# EAGLE design kilo-issue3-dual (EAGLE 9.2.2)

## Sheet 1 of 2
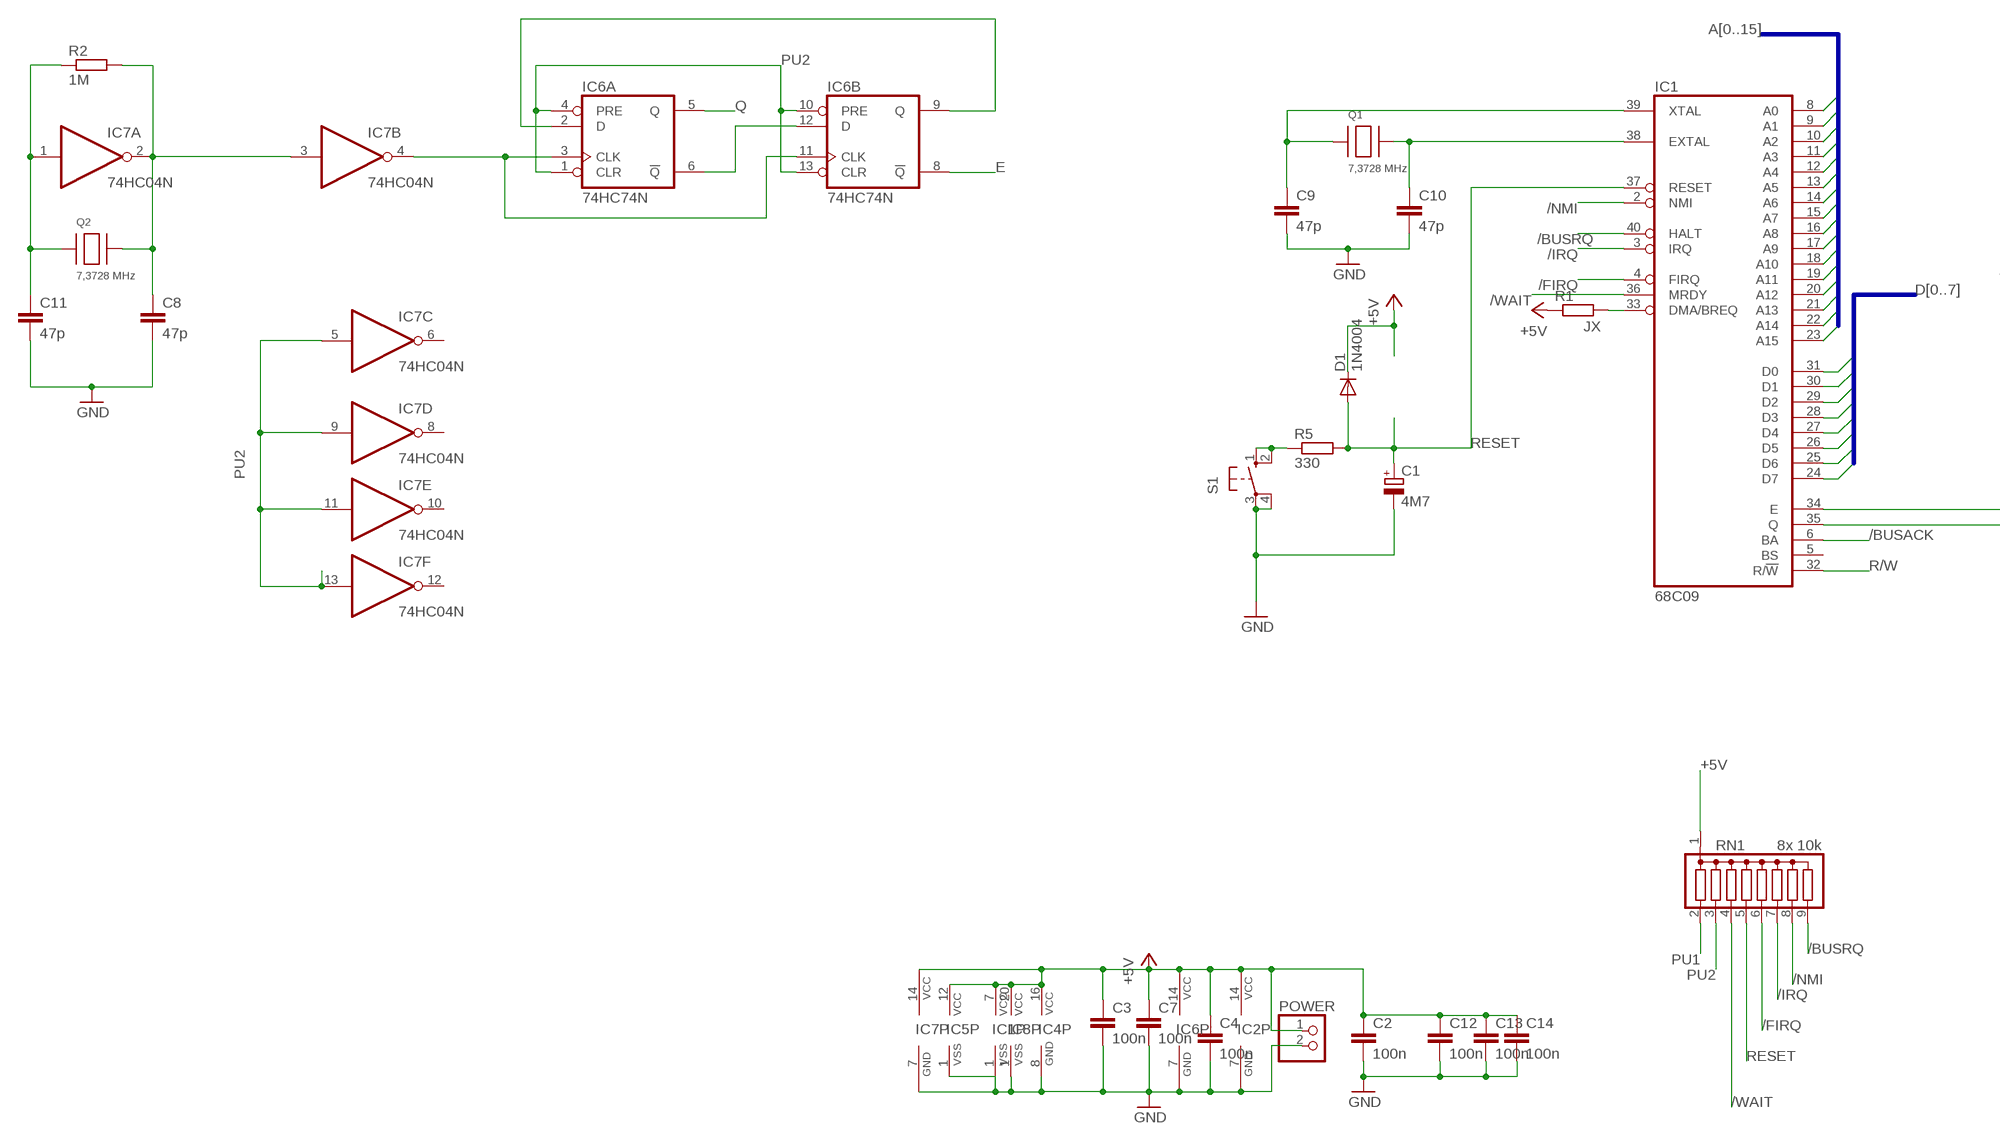
[diagram p0: schematic, sheet 1, part 1 of 2]
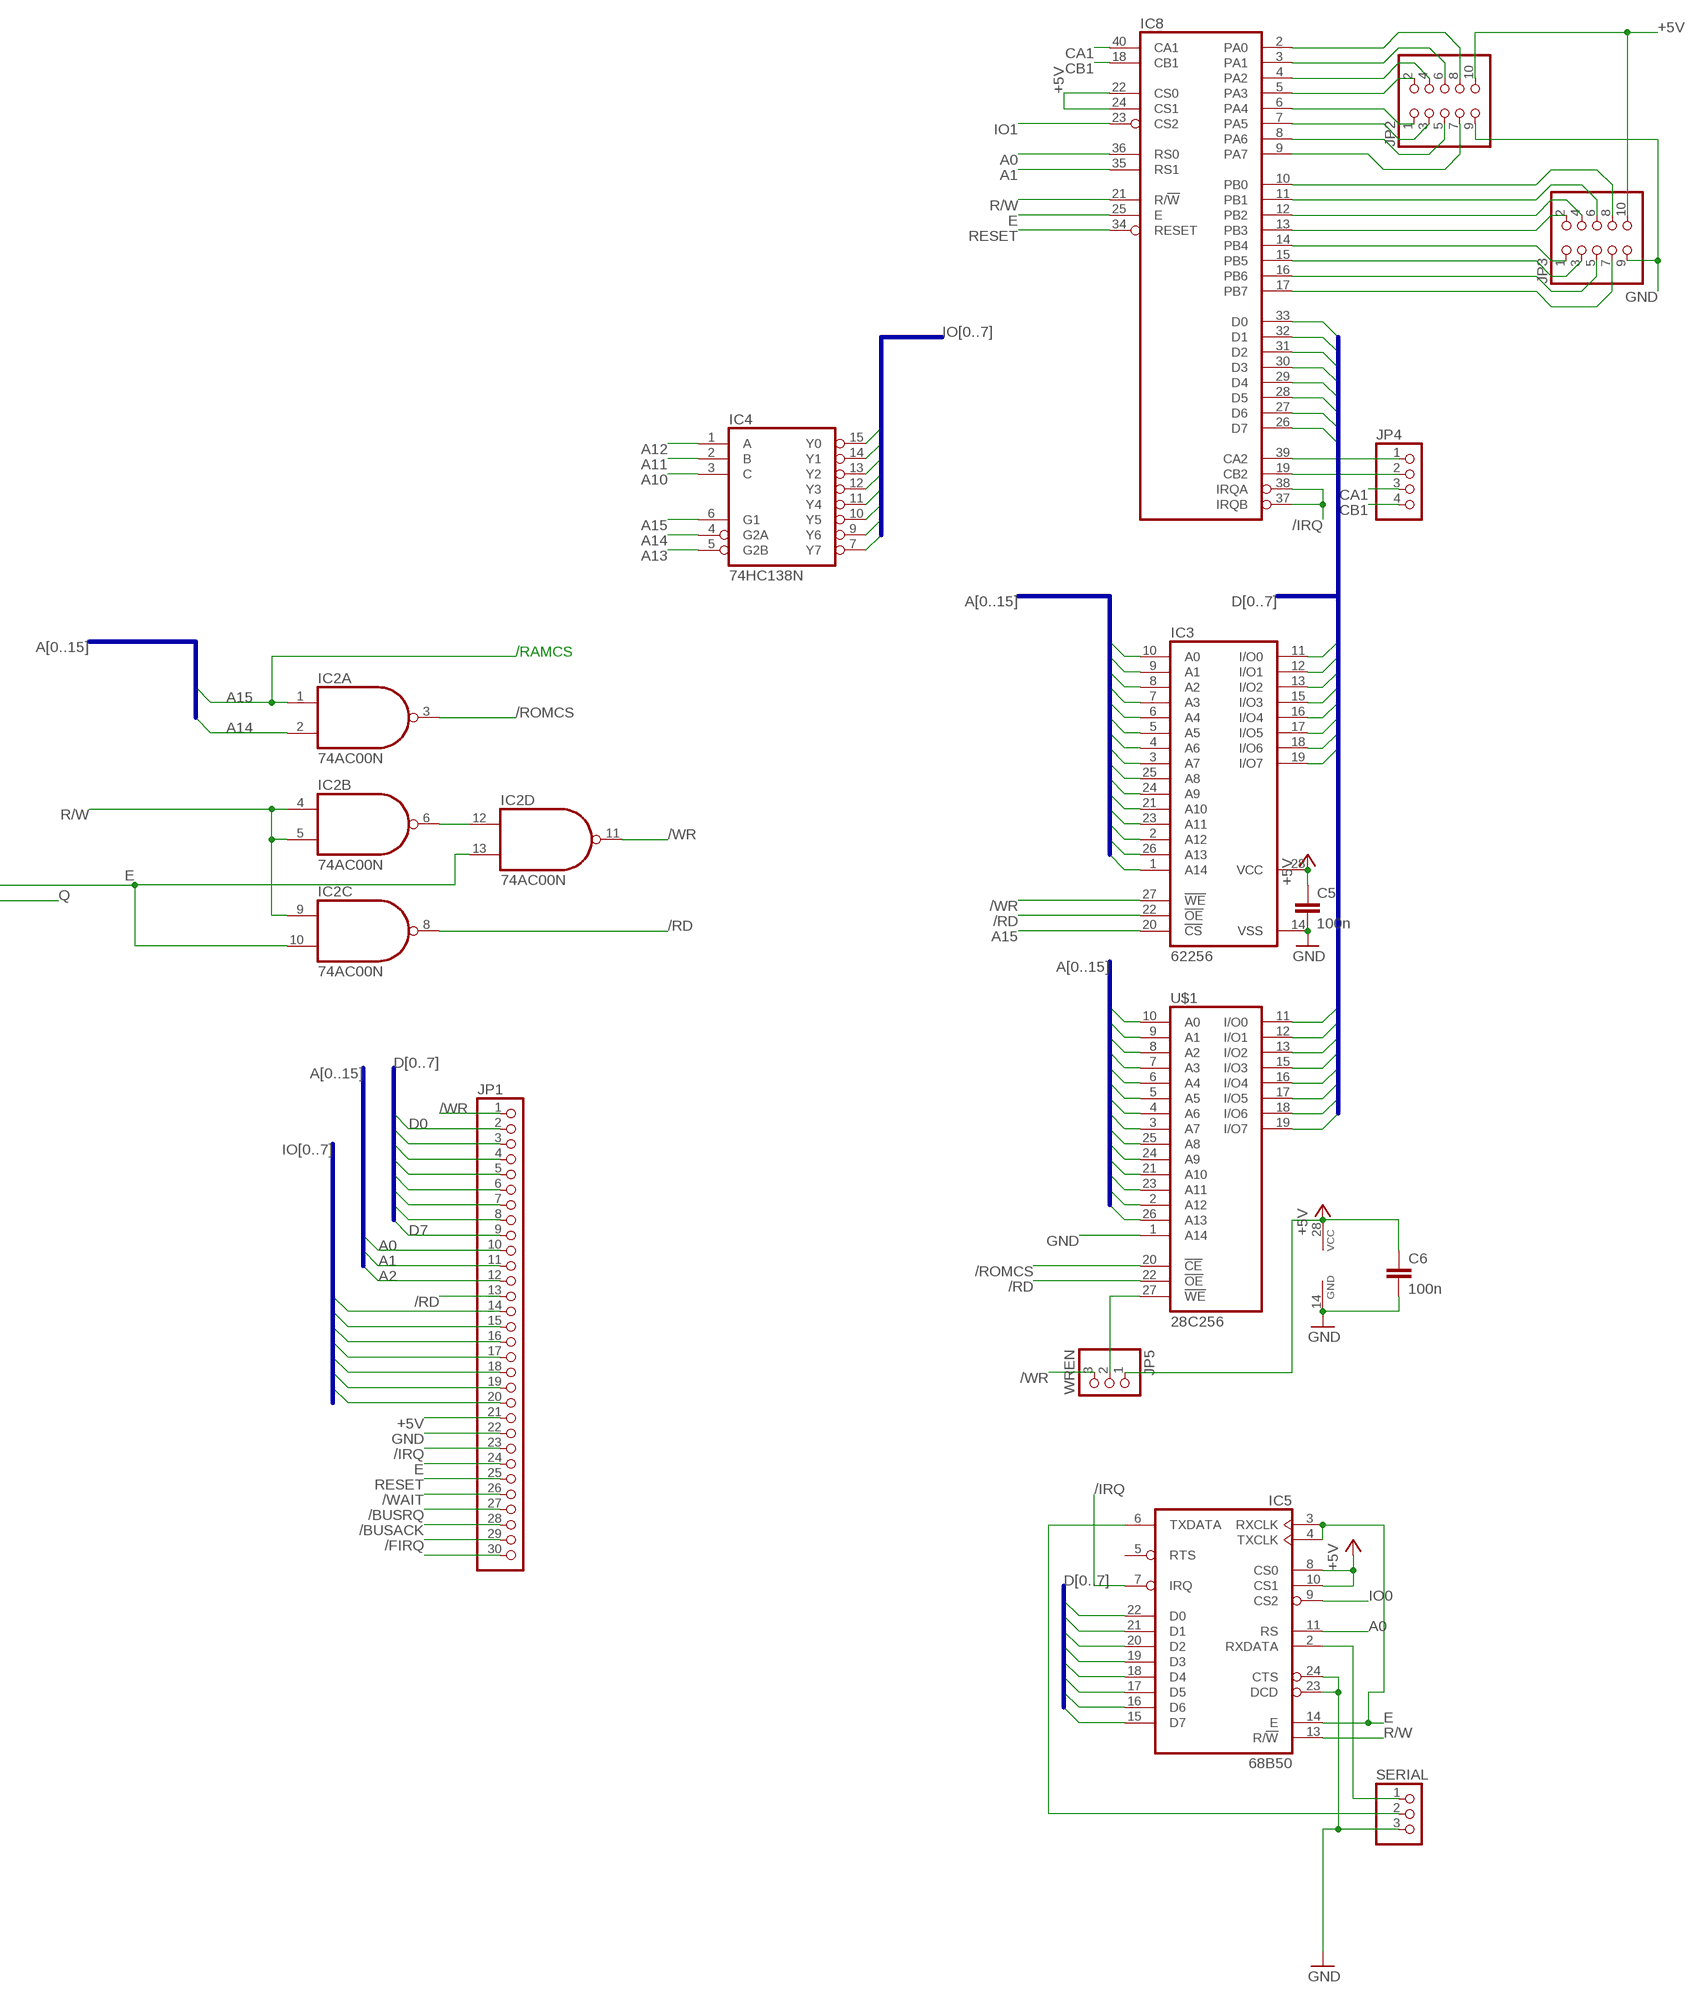
[diagram p1: schematic, sheet 1, part 2 of 2]

### Parts
C1  4M7  CPOL-EUE2.5-6  [E2,5-6]
C2  100n  C-EU025-030X050  [C025-030X050]
C3  100n  C-EU025-030X050  [C025-030X050]
C4  100n  C-EU025-030X050  [C025-030X050]
C5  100n  C-EU025-030X050  [C025-030X050]
C6  100n  C-EU025-030X050  [C025-030X050]
C7  100n  C-EU025-030X050  [C025-030X050]
C8  47p  C-EU025-030X050  [C025-030X050]
C9  47p  C-EU025-030X050  [C025-030X050]
C10  47p  C-EU025-030X050  [C025-030X050]
C11  47p  C-EU025-030X050  [C025-030X050]
C12  100n  C-EU025-030X050  [C025-030X050]
C13  100n  C-EU025-030X050  [C025-030X050]
C14  100n  C-EU025-030X050  [C025-030X050]
D1  1N4004  [DO41-10]
IC1  68C09  6809  [DIL40]
IC2  74AC00N  74ALS00N  [DIL14]
IC3  62256  62256P  [DIL28-6]
IC4  74HC138N  [DIL16]
IC5  68B50  6850  [DIL24]
IC6  74HC74N  74LS74N  [DIL14]
IC7  74HC04N  74ALS04N  [DIL14]
IC8  6821  [DIL40]
JP1  PINHD-1X30  [1X30]
JP2  PINHD-2X5  [2X05]
JP3  PINHD-2X5  [2X05]
JP4  PINHD-1X4  [1X04]
JP5  WREN  PINHD-1X3  [1X03]
POWER  PINHD-1X2  [1X02]
Q1  7,3728 MHz  306010080_XTAL_8MHZ_HC49US  [HC49US]
Q2  7,3728 MHz  306010080_XTAL_8MHZ_HC49US  [HC49US]
R1  JX  R-EU_M0805  [M0805]
R2  1M  R-EU_0207/7  [0207/7]
R5  330  R-EU_0207/7  [0207/7]
RN1  8x 10k  G08R  [SIL9]
S1  40-XX  [B3F-40XX]
SERIAL  PINHD-1X3  [1X03]
U$1  28C256  [DIL28]

### Nets
+5V [supply]: C2.1 C3.1 C4.1 C5.1 C6.1 C7.1 C12.1 C13.1 C14.1 D1.C IC1.7(VCC) IC2.14(P:VCC) IC3.28(VCC) IC4.16(VCC) IC5.8(CS0) IC5.10(CS1) IC5.12(VCC) IC6.14(P:VCC) IC7.14(P:VCC) IC8.20(VCC) IC8.22(CS0) IC8.24(CS1) JP1.21 JP2.10 JP3.10 JP5.1 POWER.1 R1.1 RN1.1 U$1.28(VCC)
/BUSACK: IC1.6(BA) JP1.28
/BUSRQ: IC1.40(HALT) JP1.27 RN1.9
/FIRQ: IC1.4(FIRQ) JP1.29 RN1.6
/IRQ: IC1.3(IRQ) IC5.7(IRQ) IC8.37(IRQB) IC8.38(IRQA) JP1.23 RN1.7
/NMI: IC1.2(NMI) RN1.8
/RD: IC2.8(C:O) IC3.22(!OE) JP1.13 U$1.22(!OE)
/ROMCS: IC2.3(A:O) U$1.20(!CE)
/WAIT: IC1.36(MRDY) JP1.26 RN1.4
/WR: IC2.11(D:O) IC3.27(!WE) JP1.1 JP5.3
A0: IC1.8(A0) IC3.10(A0) IC5.11(RS) IC8.36(RS0) JP1.10 U$1.10(A0)
A1: IC1.9(A1) IC3.9(A1) IC8.35(RS1) JP1.11 U$1.9(A1)
A2: IC1.10(A2) IC3.8(A2) JP1.12 U$1.8(A2)
A3: IC1.11(A3) IC3.7(A3) U$1.7(A3)
A4: IC1.12(A4) IC3.6(A4) U$1.6(A4)
A5: IC1.13(A5) IC3.5(A5) U$1.5(A5)
A6: IC1.14(A6) IC3.4(A6) U$1.4(A6)
A7: IC1.15(A7) IC3.3(A7) U$1.3(A7)
A8: IC1.16(A8) IC3.25(A8) U$1.25(A8)
A9: IC1.17(A9) IC3.24(A9) U$1.24(A9)
A10: IC1.18(A10) IC3.21(A10) IC4.3(C) U$1.21(A10)
A11: IC1.19(A11) IC3.23(A11) IC4.2(B) U$1.23(A11)
A12: IC1.20(A12) IC3.2(A12) IC4.1(A) U$1.2(A12)
A13: IC1.21(A13) IC3.26(A13) IC4.5(G2B) U$1.26(A13)
A14: IC1.22(A14) IC2.2(A:I1) IC3.1(A14) IC4.4(G2A)
A15: IC1.23(A15) IC2.1(A:I0) IC3.20(!CS) IC4.6(G1)
CA1: IC8.40(CA1) JP4.3
CB1: IC8.18(CB1) JP4.4
D0: IC1.31(D0) IC3.11(I/O0) IC5.22(D0) IC8.33(D0) JP1.2 U$1.11(I/O0)
D1: IC1.30(D1) IC3.12(I/O1) IC5.21(D1) IC8.32(D1) JP1.3 U$1.12(I/O1)
D2: IC1.29(D2) IC3.13(I/O2) IC5.20(D2) IC8.31(D2) JP1.4 U$1.13(I/O2)
D3: IC1.28(D3) IC3.15(I/O3) IC5.19(D3) IC8.30(D3) JP1.5 U$1.15(I/O3)
D4: IC1.27(D4) IC3.16(I/O4) IC5.18(D4) IC8.29(D4) JP1.6 U$1.16(I/O4)
D5: IC1.26(D5) IC3.17(I/O5) IC5.17(D5) IC8.28(D5) JP1.7 U$1.17(I/O5)
D6: IC1.25(D6) IC3.18(I/O6) IC5.16(D6) IC8.27(D6) JP1.8 U$1.18(I/O6)
D7: IC1.24(D7) IC3.19(I/O7) IC5.15(D7) IC8.26(D7) JP1.9 U$1.19(I/O7)
E: IC1.34(E) IC2.10(C:I1) IC2.13(D:I1) IC5.3(RXCLK) IC5.4(TXCLK) IC5.14(E) IC6.8(B:!Q) IC8.25(E) JP1.24
GND [supply]: C1.- C2.2 C3.2 C4.2 C5.2 C6.2 C7.2 C8.2 C9.2 C10.2 C11.2 C12.2 C13.2 C14.2 IC1.1(VSS) IC2.7(P:GND) IC3.14(VSS) IC4.8(GND) IC5.1(VSS) IC5.23(DCD) IC5.24(CTS) IC6.7(P:GND) IC7.7(P:GND) IC8.1(VSS) JP1.22 JP2.9 JP3.9 POWER.2 S1.3(P) S1.4(P1) SERIAL.3 U$1.1(A14) U$1.14(GND)
IO0: IC4.15(Y0) IC5.9(CS2)
IO1: IC4.14(Y1) IC8.23(CS2) JP1.14
IO2: IC4.13(Y2) JP1.15
IO3: IC4.12(Y3) JP1.16
IO4: IC4.11(Y4) JP1.17
IO5: IC4.10(Y5) JP1.18
IO6: IC4.9(Y6) JP1.19
IO7: IC4.7(Y7) JP1.20
N$1: R5.1 S1.1(S) S1.2(S1)
N$2: IC1.33(DMA/BREQ) R1.2
N$3: IC6.2(A:D) IC6.9(B:Q)
N$4: IC6.3(A:CLK) IC6.11(B:CLK) IC7.4(B:O)
N$5: IC6.6(A:!Q) IC6.12(B:D)
N$6: C8.1 IC7.2(A:O) IC7.3(B:I) Q2.P$2 R2.2
N$7: C11.1 IC7.1(A:I) Q2.P$1 R2.1
N$8: JP1.30
N$9: IC8.6(PA4) JP2.1
N$10: IC2.6(B:O) IC2.12(D:I0)
N$11: IC8.7(PA5) JP2.3
N$12: IC8.8(PA6) JP2.5
N$13: IC8.9(PA7) JP2.7
N$14: IC8.5(PA3) JP2.2
N$15: IC8.4(PA2) JP2.4
N$16: IC8.3(PA1) JP2.6
N$17: IC8.2(PA0) JP2.8
N$18: IC8.13(PB3) JP3.2
N$19: IC8.14(PB4) JP3.1
N$20: IC8.12(PB2) JP3.4
N$21: IC8.15(PB5) JP3.3
N$22: IC8.11(PB1) JP3.6
N$23: IC8.16(PB6) JP3.5
N$24: IC8.17(PB7) JP3.7
N$25: IC8.10(PB0) JP3.8
N$26: IC8.39(CA2) JP4.1
N$27: IC8.19(CB2) JP4.2
N$28: JP5.2 U$1.27(!WE)
N$33: C10.1 IC1.38(EXTAL) Q1.P$2
N$35: IC5.2(RXDATA) SERIAL.1
N$36: IC5.6(TXDATA) SERIAL.2
PHI0: C9.1 IC1.39(XTAL) Q1.P$1
PU1: RN1.2
PU2: IC6.1(A:CLR) IC6.4(A:PRE) IC6.10(B:PRE) IC6.13(B:CLR) IC7.5(C:I) IC7.9(D:I) IC7.11(E:I) IC7.13(F:I) RN1.3
Q: IC1.35(Q) IC6.5(A:Q)
R/W: IC1.32(R/!W) IC2.4(B:I0) IC2.5(B:I1) IC2.9(C:I0) IC5.13(R/!W) IC8.21(R/!W)
RESET: C1.+ D1.A IC1.37(RESET) IC8.34(RESET) JP1.25 R5.2 RN1.5
Unconnected: IC1.5(BS) IC5.5(RTS) IC7.6(C:O) IC7.8(D:O) IC7.10(E:O) IC7.12(F:O)

### Buses
A[0..15]
D[0..7]
IO[0..7]

### Notes on the sheet
- /RAMCS

## Sheet 2 of 2

## Library data of the parts
C1 = rcl:CPOL-EU: POLARIZED CAPACITOR, European symbol
C2-C14 = rcl:C-EU: CAPACITOR, European symbol
D1 = adafruit:1N4004: DIODE General purpose 1N400x type rectifier (With bigger pads) http://www.ladyada.net/library/pcb/eaglelibrary.html
IC1 = micro-motorola:6809: MICROCONTROLLER/MEMORY DEVICE; MF: NTE ELECTRONICS; MPN: NTE6809; OC_FARNELL: 4530354; OC_NEWARK: 31C2459
IC2 = 74xx-us:74*00: Quad 2-input NAND gate
IC3 = memory-hitachi:62256P: MEMORY; OC_FARNELL: unknown; OC_NEWARK: unknown
IC4 = 74xx-eu:74*138: 3-line to 8-line DECODER/DEMULTIPLEXER
IC5 = micro-motorola:6850: MICROCONTROLLER/MEMORY DEVICE; MF: NTE ELECTRONICS; MPN: NTE6850; OC_FARNELL: 4899775; OC_NEWARK: 31C2457
IC6 = 74xx-us:74*74: Dual D type positive edge triggered FLIP FLOP, preset and clear
IC7 = 74xx-us:74*04: Hex INVERTER
IC8 = micro-motorola:6821: MICROCONTROLLER/MEMORY DEVICE; MF: NTE ELECTRONICS; MPN: NTE6821; OC_FARNELL: 1652403; OC_NEWARK: 29C4772
JP1 = pinhead:PINHD-1X30: PIN HEADER
JP2 JP3 = pinhead:PINHD-2X5: PIN HEADER
JP4 = pinhead:PINHD-1X4: PIN HEADER
JP5 SERIAL = pinhead:PINHD-1X3: PIN HEADER
POWER = pinhead:PINHD-1X2: PIN HEADER
Q1 Q2 = Seeed-OPL-2017-01-Crystal-Akita:306010080_XTAL_8MHZ_HC49US: HC49/US-11.35X4.65X3.6, DIP Crystal 8MHz-20pF-30ppm-80R, SKU: 306010080
R1 = rcl:R-EU_: RESISTOR, European symbol; SPICEPREFIX: R
R2 R5 = rcl:R-EU_: RESISTOR, European symbol
RN1 = resistor-sil:G08R: SIL RESISTOR; OC_FARNELL: unknown; OC_NEWARK: unknown
S1 = adafruit:40-XX: OMRON SWITCH; MF: OMRON COMPONENTS USA; MPN: B3F-4000; OC_FARNELL: 176434; OC_NEWARK: 36K3105
U$1 = memory:28C256: MEMORY

## Net classes
1 supply: width 0.61 mm

## Board
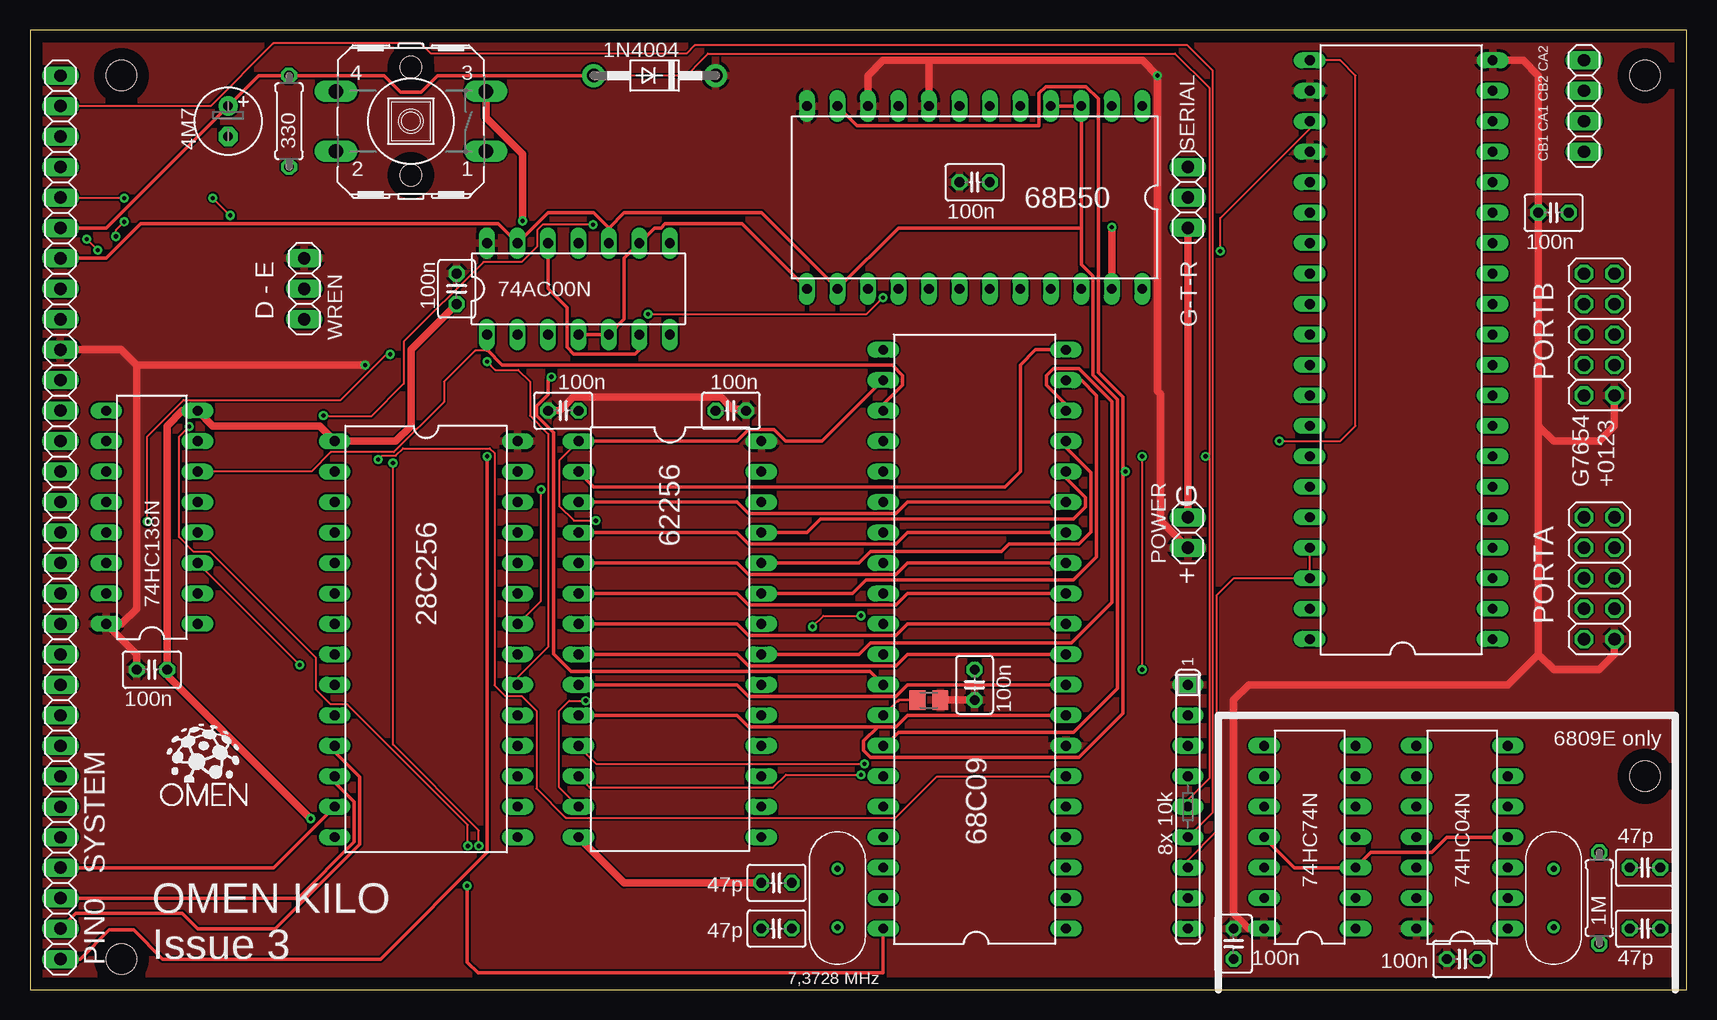
[diagram p2: board, top side]
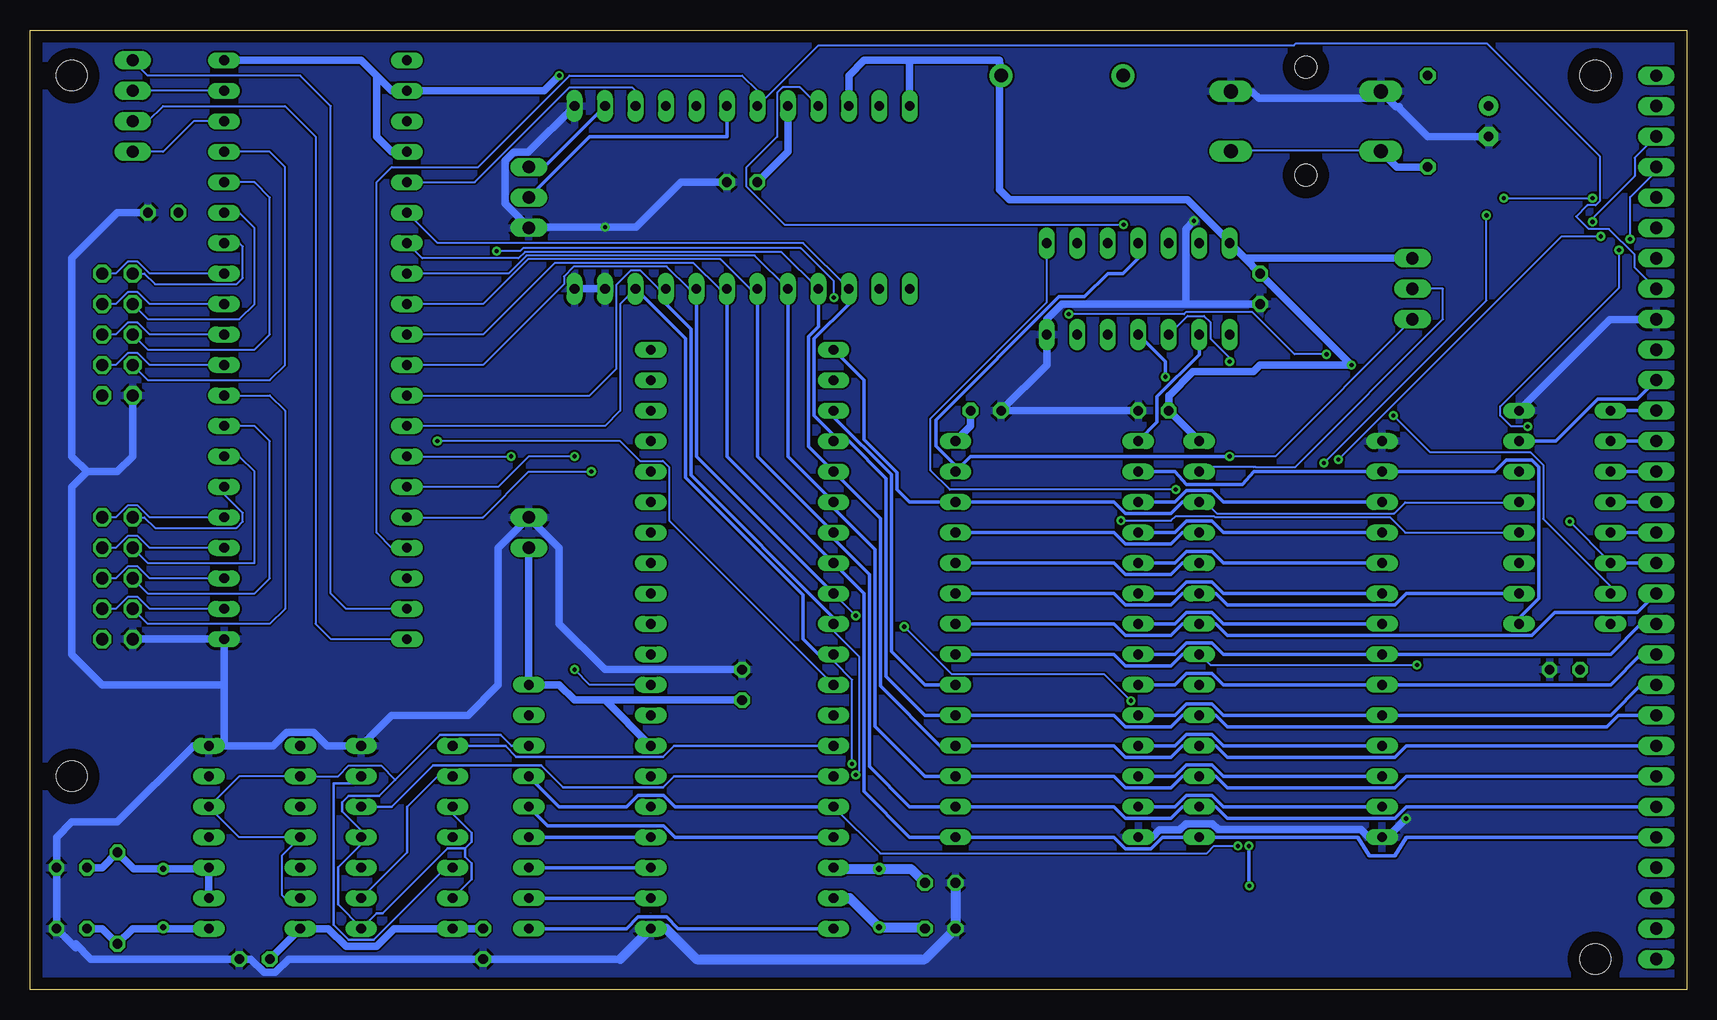
[diagram p3: board, bottom side, seen from below]

Size 138.1 x 80 mm. Coordinates in mm from the lower left corner, seen from the top.
Outline: 0,0 138.1,0 138.1,80 0,80 0,0
Copper layers (1*16): Top 0.035mm / dielectric 1.5mm / Bottom 0.035mm
Design rules "default": minimum track width 6mil, minimum drill 0.35mm, track to track 6mil, track to pad 6mil, pad to pad 6mil, via to via 6mil, smd to smd 6mil, copper to edge 40mil, drill to drill 6mil, minimum pad ring 10mil, minimum via ring 8mil, stop-mask expansion 4mil, vias tented up to drill 0mil, thermal gap 10mil
Holes 2.54 mm at 7.62,2.54 7.62,76.2 134.62,76.2 134.62,17.78

### Footprints (pad centres in the part's own frame; a part is rotated, then mirrored left to right if it is on the bottom)
E2,5-6 = drill 0.813 pad 1.6: + -1.27,0 | drill 0.813 pad 1.6 octagon: - 1.27,0
C025-030X050 = drill 0.813 octagon: 1 -1.27,0; 2 1.27,0
DO41-10 = drill 1.118 pad 1.93: A 5.08,0; C -5.08,0
DIL40 = drill 0.813 long: 1 -24.13,-7.62; 2 -21.59,-7.62; 3 -19.05,-7.62; 4 -16.51,-7.62; 5 -13.97,-7.62; 6 -11.43,-7.62; 7 -8.89,-7.62; 8 -6.35,-7.62; 9 -3.81,-7.62; 10 -1.27,-7.62; 11 1.27,-7.62; 12 3.81,-7.62; 13 6.35,-7.62; 14 8.89,-7.62; 15 11.43,-7.62; 16 13.97,-7.62; 17 16.51,-7.62; 18 19.05,-7.62; 19 21.59,-7.62; 20 24.13,-7.62; 21 24.13,7.62; 22 21.59,7.62; 23 19.05,7.62; 24 16.51,7.62; 25 13.97,7.62; 26 11.43,7.62; 27 8.89,7.62; 28 6.35,7.62; 29 3.81,7.62; 30 1.27,7.62; 31 -1.27,7.62; 32 -3.81,7.62; 33 -6.35,7.62; 34 -8.89,7.62; 35 -11.43,7.62; 36 -13.97,7.62; 37 -16.51,7.62; 38 -19.05,7.62; 39 -21.59,7.62; 40 -24.13,7.62
DIL14 = drill 0.813 long: 1 -7.62,-3.81; 2 -5.08,-3.81; 3 -2.54,-3.81; 4 0,-3.81; 5 2.54,-3.81; 6 5.08,-3.81; 7 7.62,-3.81; 8 7.62,3.81; 9 5.08,3.81; 10 2.54,3.81; 11 0,3.81; 12 -2.54,3.81; 13 -5.08,3.81; 14 -7.62,3.81
DIL28-6 = drill 0.813 long: 1 -16.51,-7.62; 2 -13.97,-7.62; 3 -11.43,-7.62; 4 -8.89,-7.62; 5 -6.35,-7.62; 6 -3.81,-7.62; 7 -1.27,-7.62; 8 1.27,-7.62; 9 3.81,-7.62; 10 6.35,-7.62; 11 8.89,-7.62; 12 11.43,-7.62; 13 13.97,-7.62; 14 16.51,-7.62; 15 16.51,7.62; 16 13.97,7.62; 17 11.43,7.62; 18 8.89,7.62; 19 6.35,7.62; 20 3.81,7.62; 21 1.27,7.62; 22 -1.27,7.62; 23 -3.81,7.62; 24 -6.35,7.62; 25 -8.89,7.62; 26 -11.43,7.62; 27 -13.97,7.62; 28 -16.51,7.62
DIL16 = drill 0.813 long: 1 -8.89,-3.81; 2 -6.35,-3.81; 3 -3.81,-3.81; 4 -1.27,-3.81; 5 1.27,-3.81; 6 3.81,-3.81; 7 6.35,-3.81; 8 8.89,-3.81; 9 8.89,3.81; 10 6.35,3.81; 11 3.81,3.81; 12 1.27,3.81; 13 -1.27,3.81; 14 -3.81,3.81; 15 -6.35,3.81; 16 -8.89,3.81
DIL24 = drill 0.813 long: 1 -13.97,-7.62; 2 -11.43,-7.62; 3 -8.89,-7.62; 4 -6.35,-7.62; 5 -3.81,-7.62; 6 -1.27,-7.62; 7 1.27,-7.62; 8 3.81,-7.62; 9 6.35,-7.62; 10 8.89,-7.62; 11 11.43,-7.62; 12 13.97,-7.62; 13 13.97,7.62; 14 11.43,7.62; 15 8.89,7.62; 16 6.35,7.62; 17 3.81,7.62; 18 1.27,7.62; 19 -1.27,7.62; 20 -3.81,7.62; 21 -6.35,7.62; 22 -8.89,7.62; 23 -11.43,7.62; 24 -13.97,7.62
1X30 = drill 1.016 long: 1 -36.83,0; 2 -34.29,0; 3 -31.75,0; 4 -29.21,0; 5 -26.67,0; 6 -24.13,0; 7 -21.59,0; 8 -19.05,0; 9 -16.51,0; 10 -13.97,0; 11 -11.43,0; 12 -8.89,0; 13 -6.35,0; 14 -3.81,0; 15 -1.27,0; 16 1.27,0; 17 3.81,0; 18 6.35,0; 19 8.89,0; 20 11.43,0; 21 13.97,0; 22 16.51,0; 23 19.05,0; 24 21.59,0; 25 24.13,0; 26 26.67,0; 27 29.21,0; 28 31.75,0; 29 34.29,0; 30 36.83,0
2X05 = drill 1.016 octagon: 1 -5.08,-1.27; 2 -5.08,1.27; 3 -2.54,-1.27; 4 -2.54,1.27; 5 0,-1.27; 6 0,1.27; 7 2.54,-1.27; 8 2.54,1.27; 9 5.08,-1.27; 10 5.08,1.27
1X04 = drill 1.016 long: 1 -3.81,0; 2 -1.27,0; 3 1.27,0; 4 3.81,0
1X03 = drill 1.016 long: 1 -2.54,0; 2 0,0; 3 2.54,0
1X02 = drill 1.016 long: 1 -1.27,0; 2 1.27,0
HC49US = drill 0.5: P$1 -2.44,0; P$2 2.44,0
M0805 = smd 1.3 x 1.6: 1 -0.95,0; 2 0.95,0
0207/7 = drill 0.813 octagon: 1 -3.81,0; 2 3.81,0
SIL9 = drill 0.813 long: 1 -10.16,0; 2 -7.62,0; 3 -5.08,0; 4 -2.54,0; 5 0,0; 6 2.54,0; 7 5.08,0; 8 7.62,0; 9 10.16,0
B3F-40XX = drill 1.194 long: 1 -6.248,2.489; 2 6.248,2.489; 3 -6.248,-2.489; 4 6.248,-2.489 | hole 1.803: 0,-4.496; 0,4.496
DIL28 = drill 0.813 long: 1 -16.51,-7.62; 2 -13.97,-7.62; 3 -11.43,-7.62; 4 -8.89,-7.62; 5 -6.35,-7.62; 6 -3.81,-7.62; 7 -1.27,-7.62; 8 1.27,-7.62; 9 3.81,-7.62; 10 6.35,-7.62; 11 8.89,-7.62; 12 11.43,-7.62; 13 13.97,-7.62; 14 16.51,-7.62; 15 16.51,7.62; 16 13.97,7.62; 17 11.43,7.62; 18 8.89,7.62; 19 6.35,7.62; 20 3.81,7.62; 21 1.27,7.62; 22 -1.27,7.62; 23 -3.81,7.62; 24 -6.35,7.62; 25 -8.89,7.62; 26 -11.43,7.62; 27 -13.97,7.62; 28 -16.51,7.62

### Placement (x,y rotation side)
C1  16.51,72.39 270 top
C2  58.42,48.26 180 top
C3  44.45,48.26 0 top
C4  10.16,26.67 0 top
C5  35.56,58.42 270 top
C6  78.74,25.4 90 top
C7  78.74,67.31 0 top
C8  134.62,10.16 0 top
C9  62.23,5.08 180 top
C10  62.23,8.89 180 top
C11  134.62,5.08 0 top
C12  100.33,3.81 270 top
C13  119.38,2.54 0 top
C14  127,64.77 0 top
D1  52.07,76.2 180 top
IC1  78.74,29.21 90 top
IC2  45.72,58.42 0 top
IC3  53.34,29.21 270 top
IC4  10.16,39.37 90 top
IC5  78.74,66.04 180 top
IC6  106.68,12.7 90 top
IC7  119.38,12.7 90 top
IC8  114.3,53.34 90 top
JP1  2.54,39.37 90 top
JP2  130.81,34.29 270 top
JP3  130.81,54.61 270 top
JP4  129.54,73.66 270 top
JP5  22.86,58.42 270 top
POWER  96.52,38.1 90 top
Q1  67.31,7.62 90 top
Q2  127,7.62 90 top
R1  74.93,24.13 180 top
R2  130.81,7.62 90 top
R5  21.59,72.39 90 top
RN1  96.52,15.24 270 top
S1  31.75,72.39 180 top
SERIAL  96.52,66.04 270 top
U$1  33.02,29.21 270 top

### Tracks (layer width: path | path; a pad name or v marks a point on that pad's centre or on a via)
+5V  (via drill 0.35)
  Top 0.61: 8.89,52.07 8.89,31.75 7.62,30.48 IC4.16 8.89,27.94 C4.1 | 8.89,52.07 7.62,53.34 JP1.21 | POWER.1 94.23,39.12 94.23,49.65 93.98,49.9 v93.98,76.2 92.71,77.47 74.93,77.47 | 74.93,77.47 71.12,77.47 69.85,76.2 IC5.10 | C3.1 44.14,48.26 45.26,49.38 57.61,49.38 58.58,48.41 59.53,48.41 C2.1 | v27.94,52.07 8.89,52.07 | 40.69,45.72 U$1.28 | IC5.8 74.93,77.47 | R1.1 C6.1 | IC8.20 124.46,77.47 125.73,76.2 C14.1 125.73,46.99 | 125.73,46.99 127,45.72 130.81,45.72 132.08,46.99 JP3.10 | JP2.10 132.08,27.94 130.81,26.67 127,26.67 125.73,27.94 | 125.73,27.94 125.73,46.99 | 125.73,27.94 123.19,25.4 101.6,25.4 100.33,24.13 100.33,6.35 101.6,5.08 IC6.14
  Bottom 0.61: U$1.28 C3.1 43.18,49.53 43.13,49.53 41.15,51.51 36.12,51.51 35.56,52.07 v27.94,52.07 C5.1 36.83,60.96 | IC3.28 59.69,46.99 C2.1 | C6.1 90.17,24.13 | 90.17,24.13 92.71,24.13 93.98,25.4 RN1.1 POWER.1 | C7.1 74.93,69.85 IC5.8 | D1.C 57.3,77.47 | 57.3,77.47 64.77,77.47 | 64.77,77.47 68.58,77.47 69.85,76.2 IC5.10 | IC5.12 64.77,77.47 | 57.3,77.47 57.3,66.67 56.46,65.84 41.6,65.84 38.25,62.48 IC2.14 37.47,61.59 36.83,60.96 | IC1.7 90.17,24.13 | IC8.20 110.49,77.47 109.22,76.2 | 109.22,76.2 107.95,74.93 IC8.22 95.25,74.93 v93.98,76.2 | IC8.24 107.95,69.85 109.22,71.12 109.22,76.2 | C12.1 IC6.14 107.75,5.08 109.22,3.61 111.76,3.61 113.23,5.08 IC7.14 C13.1 | JP5.1 36.83,60.96
  pour Top: 0,80.01 138.43,80.01 138.43,0 0,0
/BUSACK  (via drill 0.35)
  Top 0.152: v29.03,44.2 29.34,44.5 30.48,44.5 31.09,45.11 38.33,45.11 38.71,44.73 38.71,25.38 39.62,24.46 41,24.46 42.22,23.24 42.22,16.76 44.65,14.33 72.16,14.33 75.59,17.75 86.33,17.75 IC1.6 | v7.16,62.79 7.16,63.32 v7.85,64.01
  Bottom 0.152: v29.03,44.2 10.44,62.79 v7.16,62.79 | v7.85,64.01 7.85,64.31 4.34,67.82 4.34,69.34 2.59,71.09 JP1.28
/BUSRQ  (via drill 0.35)
  Top 0.152: v5.64,61.65 v4.72,62.56 | v13.26,46.94 12.42,46.1 12.42,37.72 13.64,36.5 15.01,36.5 23.85,27.66 23.85,24.99 25.07,23.77 26.44,23.77 36.5,13.72 v36.5,11.96
  Top 0.305: IC1.40 71.12,1.39 37.34,1.39 36.45,2.29 v36.45,8.64
  Bottom 0.152: v4.72,62.56 4.72,66.06 2.59,68.2 2.59,68.58 JP1.27 | v5.64,61.65 5.64,58.52 15.54,48.62 15.54,47.85 14.63,46.94 v13.26,46.94
  Bottom 0.305: IC1.40 84.08,5.08 85.05,6.04 87.42,6.04 88.39,5.08 RN1.9 | v36.45,8.64 36.5,8.69 v36.5,11.96
/FIRQ
  Top 0.152: RN1.6 98.6,14.78 98.6,76.61 96.5,78.72 55.4,78.72 54.71,78.03 33.43,78.03 32.58,78.88 20.27,78.88 15.05,73.66 JP1.29
  Bottom 0.305: IC1.4 RN1.6
/IRQ
  Top 0.152: RN1.7 96.52,10.78 98.91,13.17 98.91,32.87 100.33,34.29 IC8.38 IC8.37
  Bottom 0.152: JP1.23 2.59,58.45 4.34,60.2 4.34,61.27 6.48,63.4 8.15,63.4 9.21,64.45 8.28,65.38 7.6,65.38 7.24,65.74 7.24,69.47 16.65,78.88 32.58,78.88 32.74,78.72 72.39,78.72 77.42,73.69 IC5.7 77.47,74.93 78.74,76.2 93.12,76.2 100.74,68.58 107.95,68.58 109.22,67.31 109.22,38.1 107.95,36.83 IC8.37
  Bottom 0.305: IC1.3 RN1.7
/NMI
  Bottom 0.305: IC1.2 RN1.8
/RD  (via drill 0.35)
  Top 0.152: v42.6,41.68 42.6,32.38 40.69,30.48 U$1.22
  Bottom 0.152: IC2.8 53.34,57.3 63.02,47.62 63.02,43.28 61.42,41.68 v42.6,41.68
  Bottom 0.305: IC3.22 47.74,30.48 46.78,29.52 42.98,29.52 42.02,30.48 U$1.22 39.26,30.48 38.3,29.52 12.91,29.52 10.98,31.45 4.12,31.45 JP1.13
/ROMCS  (via drill 0.35)
  Top 0.152: v38.1,52.35 38.79,51.66 40.69,51.66 41.68,50.67 41.68,47.85 43.2,46.33 43.2,28.57 40.69,26.06 40.69,25.45 U$1.20
  Bottom 0.152: v38.1,52.35 38.1,52.65 39.7,54.25 39.7,55.63 40.23,56.16 41.6,56.16 43.13,54.63 IC2.3
/WAIT  (via drill 0.35)
  Top 0.152: v7.85,65.99 2.59,65.99 JP1.26 | v16.69,64.54 v15.24,65.99 | v30.25,43.89 30.25,20.42 37.41,13.26 v37.41,11.96
  Bottom 0.152: v15.24,65.99 v7.85,65.99 | v16.69,64.54 16.69,57.45 v30.25,43.89 | v37.41,11.96 39.4,11.96 40.01,11.35 67.21,11.35 71.02,15.16 IC1.36
  Bottom 0.305: RN1.4 93.98,15.24 88.39,15.24 87.42,16.2 85.3,16.2 84.33,15.24 IC1.36
/WR  (via drill 0.35)
  Top 0.305: v38.1,44.45 38.1,11.43 29.21,2.54 11.07,2.54 8.63,4.98 6.61,4.98 4.17,2.54 JP1.1
  Bottom 0.152: JP5.3 34.29,44.45 v38.1,44.45
  Bottom 0.305: IC2.11 45.72,60.96 46.99,59.69 48.26,59.69 50.19,57.76 52.32,57.76 62.59,47.5 62.59,45.32 60.96,43.7 IC3.27 59.69,44.45 v38.1,44.45
A0  (via drill 0.35)
  Top 0.152: v91.31,43.18 91.08,43.18
  Top 0.305: IC1.8 73.14,22.86 72.18,21.89 70.67,21.89 | IC3.10 58.94,22.86 59.9,21.89 70.67,21.89 | IC5.11 68.94,72.03 84.12,72.03 84.12,74.72 84.69,75.29 88.03,75.29 89.05,74.26 89.05,51.43 91.08,49.39 91.08,43.18 91.08,23.02 87.42,19.36 70.06,19.36 69.49,19.92 69.49,20.72 70.67,21.89
  Bottom 0.152: IC8.36 100.33,39.37 96.52,43.18 v91.31,43.18
  Bottom 0.305: IC3.10 42.66,22.86 41.7,23.82 39.58,23.82 38.62,22.86 U$1.10 6.35,22.86 3.81,25.4 JP1.10
A1  (via drill 0.35)
  Top 0.152: v92.71,26.67 v92.71,44.45
  Top 0.305: IC1.9 73.14,25.4 72.18,24.43 59.9,24.43 58.94,25.4 IC3.9
  Bottom 0.152: IC1.9 91.44,25.4 v92.71,26.67 | v92.71,44.45 96.52,44.45 99.06,41.91 IC8.35
  Bottom 0.305: IC3.9 42.66,25.4 41.7,26.36 39.58,26.36 38.62,25.4 U$1.9 6.35,25.4 3.81,27.94 JP1.11
A2
  Top 0.305: IC1.10 73.14,27.94 72.18,26.98 59.9,26.98 58.94,27.94 IC3.8
  Bottom 0.305: IC3.8 42.66,27.94 41.7,28.91 39.58,28.91 38.62,27.94 U$1.8 6.35,27.94 3.81,30.48 JP1.12
A3
  Top 0.305: IC1.11 73.14,30.48 72.18,29.52 59.9,29.52 58.94,30.48 IC3.7
  Bottom 0.305: U$1.7 38.62,30.48 39.58,31.45 41.7,31.45 42.66,30.48 IC3.7
A4
  Top 0.305: IC1.12 73.14,33.02 72.18,32.05 59.9,32.05 58.94,33.02 IC3.6
  Bottom 0.305: U$1.6 38.62,33.02 39.58,33.98 41.7,33.98 42.66,33.02 IC3.6
A5
  Top 0.305: IC1.13 73.14,35.56 72.18,34.59 59.9,34.59 58.94,35.56 IC3.5
  Bottom 0.305: U$1.5 38.62,35.56 39.58,36.52 41.7,36.52 42.66,35.56 IC3.5
A6
  Top 0.305: IC1.14 73.14,38.1 72.18,37.13 59.9,37.13 58.94,38.1 IC3.4
  Bottom 0.305: U$1.4 38.62,38.1 39.58,39.06 41.7,39.06 42.66,38.1 IC3.4
A7
  Top 0.305: IC1.15 73.14,40.64 72.18,39.67 59.9,39.67 58.94,40.64 IC3.3
  Bottom 0.305: U$1.3 38.62,40.64 39.58,41.6 41.7,41.6 42.66,40.64 IC3.3
A8
  Top 0.305: IC1.16 86.36,42.66 87.99,41.04 87.99,40.24 86.96,39.22 65.89,39.22 64.77,38.1 IC3.25
  Bottom 0.305: U$1.25 42.02,38.1 42.98,37.13 46.78,37.13 47.74,38.1 IC3.25
A9
  Top 0.305: IC1.17 86.36,45.2 88.44,43.12 88.44,38.16 87.42,37.13 81.58,37.13 80.97,36.52 70.06,36.52 69.09,35.56 IC3.24
  Bottom 0.305: U$1.24 42.02,35.56 42.98,34.59 46.78,34.59 47.74,35.56 IC3.24
A10  (via drill 0.35)
  Top 0.152: v22.48,27.05 IC4.3
  Top 0.305: IC1.18 86.36,48.77 84.73,50.4 84.73,51.2 85.3,51.77 87.42,51.77 90.17,49.02 90.17,32.27 86.81,28.91 70.06,28.91 69.09,27.94 IC3.21
  Bottom 0.152: v22.48,27.05 39.7,27.05 40.54,27.89 U$1.21
  Bottom 0.305: U$1.21 42.02,27.94 42.98,26.98 46.78,26.98 47.74,27.94 IC3.21
A11
  Top 0.305: IC3.23 68.58,33.02 69.7,34.14 86.96,34.14 88.9,36.08 88.9,49.53 87.63,50.8 IC1.19
  Bottom 0.305: IC3.23 47.74,33.02 46.78,32.05 42.98,32.05 42.02,33.02 U$1.23 39.26,33.02 38.3,32.05 24.34,32.05 23.38,33.02 IC4.2
A12
  Top 0.305: IC3.2 46.99,41.91 81.28,41.91 82.55,43.18 82.55,52.07 83.82,53.34 IC1.20
  Bottom 0.305: IC3.2 42.66,43.18 41.7,42.11 37.04,42.11 36.08,43.18 U$1.2 15.99,43.18 15.03,44.15 12.91,44.15 12.34,43.58 12.34,32.62 13.97,31 IC4.1
A13
  Bottom 0.152: IC4.5 14.02,40.62 23.47,40.62 24.38,39.7 39.17,39.7 40.01,40.54 40.54,40.54 U$1.26
  Bottom 0.305: U$1.26 42.02,40.64 42.98,39.67 46.78,39.67 47.74,40.64 IC3.26 64.77,40.64 65.84,41.71 65.84,43.11 68.58,45.85 68.58,50.8 IC1.21
A14  (via drill 0.35)
  Top 0.152: v47.17,39.09 45.34,39.09 44.12,40.31 44.12,44.12 IC3.1
  Top 0.305: IC1.22 66.04,45.72 62.98,45.72 62.02,46.69 59.9,46.69 58.94,45.72 IC3.1
  Bottom 0.152: IC4.4 23.47,38.1 24.77,39.4 39.32,39.4 39.4,39.47 42.6,39.47 42.98,39.09 v47.17,39.09
  Bottom 0.305: IC3.1 44.15,47.3 44.15,49.43 40.64,52.93 IC2.2
A15
  Top 0.152: IC4.6 14.02,43.2 23.47,43.2 25.07,44.81 30.33,44.81 34.52,49 34.52,50.67 37.11,53.26 38.02,53.26 38.1,53.34
  Top 0.305: IC1.23 71.12,48.77 72.75,50.4 72.75,51.2 71.88,52.07 39.37,52.07 38.1,53.34 IC2.1
  Bottom 0.305: IC1.23 71.12,47.74 66.29,42.92 66.29,28.19 63.5,25.4 IC3.20
CA1
  Bottom 0.152: JP4.3 128.27,72.39 127,73.66 116.84,73.66 114.3,71.12 114.3,30.48 113.03,29.21 IC8.40
CB1
  Bottom 0.152: IC8.18 124.46,72.39 127,69.85 JP4.4
D0  (via drill 0.35)
  Top 0.152: v69.57,18.82 47.17,18.82 45.72,20.27 IC3.11
  Top 0.305: U$1.11 25.4,19.8 27.48,17.72 27.48,12.11 20.45,5.08 13.97,5.08 12.7,6.35 3.81,6.35 JP1.2
  Bottom 0.152: v69.57,18.82 69.57,25.83 71.09,27.36 71.09,27.81 IC1.31 | IC5.22 88.9,57.15 88.9,48.26 90.17,46.99 IC8.33
  Bottom 0.305: U$1.11 38.62,20.32 39.58,21.29 41.7,21.29 42.66,20.32 IC3.11 | IC5.22 83.46,54.25 83.46,42.69 73.66,32.89 73.66,29.21 72.39,27.94 IC1.31
D1  (via drill 0.35)
  Top 0.152: v69.27,17.91 63.02,17.91 61.95,16.84 46.63,16.84 45.72,17.75 IC3.12
  Top 0.305: U$1.12 25.4,17.27 27.03,15.64 27.03,12.3 22.34,7.62 JP1.3
  Bottom 0.152: v69.27,17.91 68.96,18.21 68.96,27.74 71.02,29.79 71.02,30.4 IC1.30 | IC8.32 91.44,49.53 89.2,51.77 89.2,58.76 88,59.97 87.26,59.97 85.71,58.42 IC5.21
  Bottom 0.305: U$1.12 38.62,17.78 39.58,18.75 41.7,18.75 42.66,17.78 IC3.12 | IC5.21 85.09,57.15 83.01,55.07 83.01,42.88 71.12,31 IC1.30
D2  (via drill 0.35)
  Top 0.152: v69.27,31.17 66.14,31.17 v65.23,30.25 | v46.33,24.08 44.96,24.08 44.12,23.24 44.12,16.84 IC3.13
  Top 0.305: U$1.13 20.32,10.16 JP1.4
  Bottom 0.152: v69.27,31.17 IC1.29 | v65.23,30.25 61.27,26.29 48.54,26.29 v46.33,24.08 | IC5.20 83.17,58.42 85.03,60.27 92.77,60.27 93.6,59.45 93.6,58.8 100.33,52.07 IC8.31
  Bottom 0.305: U$1.13 38.62,15.24 39.58,16.2 41.7,16.2 42.66,15.24 IC3.13 | IC5.20 82.55,44.45 IC1.29
D3
  Bottom 0.152: IC5.19 80.63,58.42 82.79,60.58 94.36,60.58 100.33,54.61 IC8.30
  Bottom 0.305: JP1.5 23.38,12.7 24.34,11.12 26.46,11.12 27.43,12.7 U$1.15 43.7,12.7 44.66,11.73 46.78,11.73 47.74,12.7 IC3.15 64.77,12.7 68.58,16.51 68.58,33.02 IC1.28 80.01,44.45 IC5.19
D4
  Bottom 0.152: IC5.18 78.09,58.42 80.56,60.88 96.6,60.88 100.33,57.15 IC8.29
  Bottom 0.305: JP1.6 23.38,15.24 24.34,14.28 38.3,14.28 39.26,15.24 U$1.16 42.02,15.24 42.98,14.28 46.78,14.28 47.74,15.24 IC3.16 64.77,15.24 68.12,18.59 68.12,34.59 71.12,37.59 IC1.27 77.47,44.45 IC5.18
D5
  Bottom 0.152: IC8.28 98.22,59.69 96.72,61.19 77.7,61.19 IC5.17
  Bottom 0.305: JP1.7 23.38,17.78 24.34,16.82 38.3,16.82 39.26,17.78 U$1.17 42.02,17.78 42.98,16.82 46.78,16.82 47.74,17.78 IC3.17 63.5,17.78 67.67,21.95 67.67,36.67 71.12,40.12 IC1.26 74.93,44.45 IC5.17
D6
  Bottom 0.152: IC5.16 75.46,61.49 96.85,61.49 97.38,60.96 105.41,60.96 IC8.27
  Bottom 0.305: JP1.8 23.38,20.32 24.34,19.36 38.3,19.36 39.26,20.32 U$1.18 42.02,20.32 42.98,19.36 46.78,19.36 47.74,20.32 IC3.18 62.23,20.32 67.21,25.3 67.21,39.27 IC1.25 73.2,45.26 73.2,54.44 72.39,55.26 IC5.16
D7
  Bottom 0.152: IC5.15 73.66,62.23 104.14,62.23 IC8.26
  Bottom 0.305: JP1.9 5.7,22.86 6.67,21.89 38.3,21.89 39.26,22.86 U$1.19 42.02,22.86 42.98,21.89 46.78,21.89 47.74,22.86 IC3.19 63.5,22.86 66.75,26.11 66.75,42.62 69.85,45.72 IC1.24 71.12,46.23 72.75,47.86 72.75,54.25 69.85,57.15 IC5.15
E
  Top 0.152: IC2.10 48.23,62.26 48.23,63.4 48.26,63.5
  Top 0.305: 87.63,63.5 87.63,60.45 88.59,59.48 88.59,51.24 90.63,49.2 90.63,25.1 86.96,21.44 72.39,21.44 71.27,20.32 IC1.34 | 87.63,63.5 IC5.3 IC5.4 | 87.63,63.5 72.39,63.5 IC5.14 60.96,64.77 49.53,64.77 48.26,63.5 46.99,64.77 43.18,64.77 IC2.13 39.01,63.86 9.25,63.86 6.35,60.96 JP1.24
  Bottom 0.152: IC8.25 101.03,67.31 93.13,75.21 87.91,75.21 87.63,74.93 IC5.3
  Bottom 0.203: IC6.8 98.47,20.32 97.56,19.41 85.32,19.41 84.41,20.32 IC1.34
GND  (via drill 0.35)
  Top 0.61: SERIAL.3 POWER.2 | C10.2 49.53,8.89 IC3.14 | C5.2 31.75,53.34 31.75,46.99 30.48,45.72 U$1.1 24.13,46.99 15.24,46.99 IC4.8 12.7,48.26 11.43,46.99 C4.2 11.58,26.44 11.58,26.06 v23.39,14.25 | v41.07,64.08 41.07,69.65 38.02,72.69 38.02,74.83 S1.3 | IC5.23 v90.17,63.55
  Bottom 0.61: C3.2 C2.2 53.34,52.07 IC2.7 53.34,55.88 52.07,57.15 41.76,57.15 | C7.2 83.82,67.31 87.58,63.55 v90.17,63.55 96.52,63.55 | C6.2 90.17,26.67 93.98,30.48 93.98,36.83 POWER.2 99.06,36.83 99.06,25.4 101.6,22.86 107.95,22.86 IC6.7 113.33,20.32 114.45,21.44 116.69,21.44 117.81,20.32 121.92,20.32 | SERIAL.3 96.52,63.55 | 96.52,63.55 98.5,65.53 98.5,69.08 97.79,69.8 96.57,69.8 IC5.1 | IC3.14 44.56,12.7 43.95,13.31 42.27,13.31 41.76,13.82 39.52,13.82 39.05,13.35 27.16,13.35 26.5,12.7 U$1.14 25.15,12.8 24.84,12.8 v23.39,14.25 | C5.2 41.76,57.15 | S1.3 37.95,74.83 36.2,74.83 35.66,74.3 26.21,74.3 25.76,74.75 S1.4 24.23,73.61 23.97,73.61 24.05,73.58 21.59,71.12 C1.- | v41.07,64.08 41.76,63.4 41.76,57.15 | JP1.22 2.59,55.85 6.4,55.85 13.95,48.31 IC4.8 | 121.92,20.32 IC7.7 124.46,20.32 130.81,13.97 134.62,13.97 135.89,12.7 C8.2 C11.2 134.3,3.49 134.3,3.81 133.03,2.54 C13.2 119.69,2.54 118.57,1.42 117.65,1.42 116.53,2.54 C12.2 88.9,2.54 | 121.92,25.4 IC8.1 JP2.9 | 121.92,25.4 121.92,20.32 | IC5.23 IC5.24 | JP3.9 129.54,44.45 130.81,43.18 133.35,43.18 | 133.35,43.18 134.62,41.91 134.62,27.94 132.08,25.4 121.92,25.4 | C14.2 130.81,64.77 134.62,60.96 134.62,44.45 133.35,43.18
  Bottom 0.813: C10.2 C9.2 63.5,2.54 82.55,2.54 85.09,5.08 IC1.1 88.9,2.54
  pour Bottom: 120.65,11.43 124.46,11.43 128.27,15.24 135.89,15.24 137.16,13.97 137.16,0 120.65,0
  pour Bottom: 0,80.01 138.43,80.01 138.43,0 0,0
IO0  (via drill 0.35)
  Top 0.152: v24.46,47.85 24.84,47.85 24.92,47.78 28.42,47.78 31.17,50.52 31.17,54.03 37.8,60.66 41,60.66 42.29,61.95 42.29,63.32 42.75,63.78 v46.94,63.78
  Bottom 0.152: v24.46,47.85 21.41,44.81 13.03,44.81 11.96,43.74 11.96,39.24 6.4,33.68 6.4,33.07 IC4.15 | v46.94,63.78 75.21,63.78 78.41,66.98 78.41,68.5 75.82,71.09 75.82,74.75 75.36,75.21 73.91,75.21 72.39,73.69 IC5.9
IO1  (via drill 0.35)
  Top 0.152: IC8.23 106.68,71.78 99.21,64.31 v99.21,61.57 | v71.09,57.68 69.72,56.31 v51.51,56.31 | v30.02,52.96 29.72,52.96 25.91,49.15 12.8,49.15 9.75,46.1 v9.75,39.01
  Bottom 0.152: v99.21,61.57 97.23,61.57 97,61.8 73.84,61.8 71.09,59.05 v71.09,57.68 | v51.51,56.31 41.91,56.31 41.76,56.46 36.2,56.46 32.69,52.96 v30.02,52.96 | v9.75,39.01 6.4,35.66 IC4.14
  Bottom 0.305: JP1.14 IC4.14
IO2
  Bottom 0.305: IC4.13 JP1.15
IO3
  Bottom 0.305: JP1.16 IC4.12
IO4
  Bottom 0.305: IC4.11 JP1.17
IO5
  Bottom 0.305: JP1.18 IC4.10
IO6
  Bottom 0.305: JP1.19 IC4.9
IO7
  Bottom 0.305: JP1.20 4.12,49.23 7.41,49.23 10.91,45.72 IC4.7
N$1
  Bottom 0.152: S1.1 37.95,69.95 25.76,69.95 S1.2
  Bottom 0.61: R5.1 24.18,68.58 S1.2
N$2
  Top 0.203: IC1.33 72.29,24.03 72.35,24.03 72.45,24.13 R1.2
N$3
  Bottom 0.203: IC6.2 106.68,11.43 106.68,15.24 104.14,17.78 IC6.9
N$4
  Top 0.305: IC7.4 118.11,12.7 116.84,11.43 111.76,11.43 IC6.3 105.41,10.16 IC6.11
N$5
  Bottom 0.203: IC6.6 111.08,17.19 112.78,17.19 112.78,5.41 111.53,4.17 109.45,4.17 103.46,10.16 IC6.12
N$6
  Bottom 0.61: C8.1 132.08,10.16 R2.2 129.44,10.06 Q2.P$2 123.29,10.06 IC7.3 IC7.2
N$7
  Bottom 0.61: IC7.1 126.9,5.08 Q2.P$1 127.1,5.08 129.54,5.08 R2.1 132.08,5.08 C11.1
N$9
  Bottom 0.152: JP2.1 128.57,39.37 127.68,38.48 120.89,38.48 120.37,39 120.37,39.74 121.92,41.29 IC8.6
N$10
  Top 0.305: IC2.12 43.18,58.42 44.76,56.84 44.76,53.55 45.32,52.98 50.44,52.98 50.8,53.34 IC2.6
N$11
  Bottom 0.152: JP2.3 128.27,35.56 119.38,35.56 119.38,43.18 120.65,44.45 IC8.7
N$12
  Bottom 0.152: JP2.5 128.27,33.02 119.38,33.02 118.11,34.29 118.11,45.72 119.38,46.99 IC8.8
N$13
  Bottom 0.152: IC8.9 118.11,49.53 116.84,48.26 116.84,31.75 118.11,30.48 128.27,30.48 JP2.7
N$14
  Bottom 0.152: IC8.5 128.14,39.37 129.13,40.36 129.95,40.36 130.94,39.37 JP2.2
N$15
  Bottom 0.152: IC8.4 128.14,36.83 129.13,37.82 129.95,37.82 130.94,36.83 JP2.4
N$16
  Bottom 0.152: IC8.3 128.14,34.29 129.13,35.28 129.95,35.28 130.94,34.29 JP2.6
N$17
  Bottom 0.152: IC8.2 128.14,31.75 129.13,32.74 129.95,32.74 130.94,31.75 JP2.8
N$18
  Bottom 0.152: IC8.13 128.14,59.69 129.13,60.68 129.95,60.68 130.94,59.69 JP3.2
N$19
  Bottom 0.152: JP3.1 128.57,59.69 127.68,58.8 120.89,58.8 120.37,59.32 120.37,61.95 120.65,62.23 IC8.14
N$20
  Bottom 0.152: IC8.12 128.14,57.15 129.13,58.14 129.95,58.14 130.94,57.15 JP3.4
N$21
  Bottom 0.152: JP3.3 128.27,55.88 120.65,55.88 119.38,57.15 119.38,63.5 120.65,64.77 IC8.15
N$22
  Bottom 0.152: IC8.11 128.14,54.61 129.13,55.6 129.95,55.6 130.94,54.61 JP3.6
N$23
  Bottom 0.152: JP3.5 128.27,53.34 119.38,53.34 118.11,54.61 118.11,66.04 119.38,67.31 IC8.16
N$24
  Bottom 0.152: JP3.7 128.27,50.8 118.11,50.8 116.84,52.07 116.84,68.58 118.11,69.85 IC8.17
N$25
  Bottom 0.152: IC8.10 128.14,52.07 129.13,53.06 129.95,53.06 130.94,52.07 JP3.8
N$26
  Bottom 0.152: IC8.39 111.76,31.75 113.03,33.02 113.03,73.66 115.57,76.2 128.27,76.2 JP4.1
N$27
  Bottom 0.152: IC8.19 JP4.2
N$28
  Bottom 0.152: U$1.27 40.26,43.56 36.08,43.56 35.94,43.57 35.93,43.56 32.64,43.56 20.32,55.88 20.32,58.42 JP5.2
N$33
  Bottom 0.813: IC1.38 71.02,10.06 Q1.P$2 64.67,10.06 C10.1
N$35
  Bottom 0.305: IC5.2 95.25,68.58 SERIAL.1
N$36
  Bottom 0.305: SERIAL.2 91.44,71.12 80.01,71.12 IC5.6
PHI0
  Bottom 0.813: IC1.39 69.75,7.62 Q1.P$1 63.6,5.18 C9.1
PU2
  Bottom 0.152: 107.66,17.49 108.84,18.67 111.52,18.67 112.41,17.78 IC7.9 120.65,17.78 IC7.5 120.65,12.7 IC7.11 117.12,11.15 117.12,7.9 116.84,7.62 IC7.13
  Bottom 0.203: 101.83,11.79 103.28,11.79 108.72,6.35 109.22,6.35 IC6.1 110.49,5.16 112.42,7.09 112.42,10.18 110.49,12.11 IC6.4 110.49,13.29 112.06,14.86 112.06,15.62 111.53,16.15 108.99,16.15 107.66,17.49 103.91,21.23 98.89,21.23 97.97,20.32 RN1.3 | 101.83,11.79 101.3,12.32 101.3,13.08 102.87,14.65 IC6.10 | 101.83,11.79 101.83,11.07 101.3,10.54 101.3,9.2 IC6.13
Q
  Bottom 0.203: IC1.35 84.41,17.78 85.32,16.87 93.65,16.87 95.48,18.69 104.5,18.69 107.95,15.24 IC6.5
R/W  (via drill 0.35)
  Top 0.152: v104.14,45.72 109.22,45.72 110.49,46.99 110.49,76.2 109.22,77.47 IC8.21
  Top 0.305: IC2.4 IC2.5 49.53,55.88 49.53,60.96 IC2.9 52.07,63.5 52.59,63.5 52.94,63.86 59.33,63.86 IC5.13 | IC1.32 70,26.52 45.12,26.52 43.64,28 43.64,46.44 42.22,47.86 42.22,48.66 43.18,49.62 43.18,50.8 v43.46,51.08
  Bottom 0.152: v104.14,45.72 88.9,45.72 87.25,44.07 85.33,44.07 84.81,43.55 84.81,39.09 IC1.32
  Bottom 0.305: v43.46,51.08 43.46,52.35 IC2.4
RESET  (via drill 0.35)
  Top 0.152: 98.3,44.75 98.3,75.18 95.45,78.03 56.52,78.03 56.01,77.52 54.71,76.2 D1.A | 98.3,44.75 98.3,17.6 96.55,15.85 96.55,15.24 RN1.5 | v98,44.45 98.3,44.75
  Top 0.305: D1.A 33.99,76.2 32.61,74.82 30.89,74.82 29.51,76.2 R5.2 19.05,76.2 C1.+ 6.35,63.5 JP1.25
  Bottom 0.152: IC8.34 v98,44.45
  Bottom 0.305: IC1.37 84.33,12.7 85.3,13.66 94.94,13.66 RN1.5

### Text on the board
tNames: CB1 CA1 CB2 CA2 | D - E | G-T-R | PORTB | G7654 / +0123 | + G | PORTA | 6809E only | SYSTEM | OMEN KILO / Issue 3 | PIN0